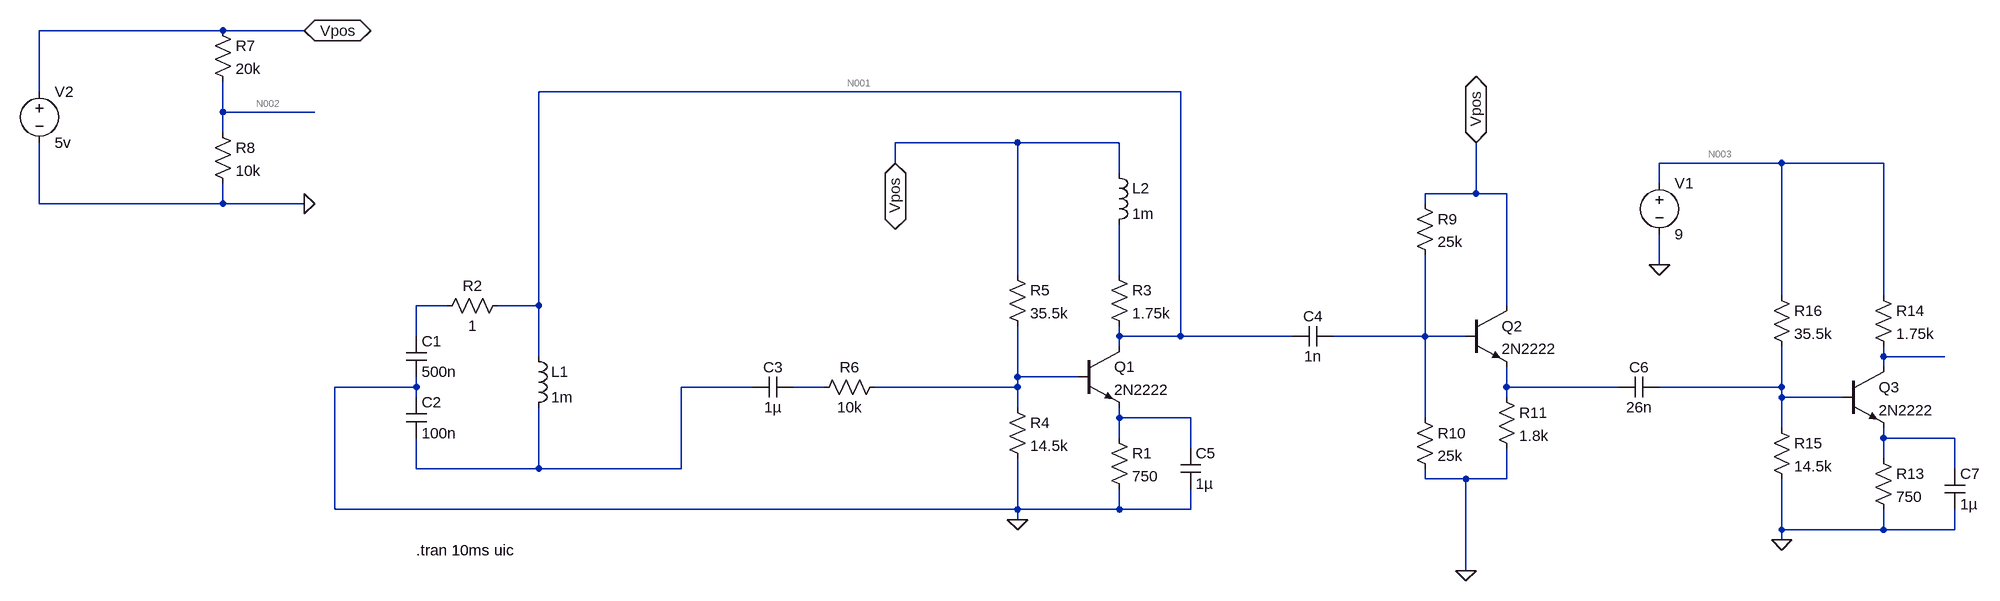
[diagram p0: schematic oscillator.asc]
oscillator.asc, the LTspice schematic file:
Version 4.1
SHEET 1 3016 680
WIRE -192 -432 -480 -432
WIRE -64 -432 -192 -432
WIRE -480 -336 -480 -432
WIRE 1312 -336 304 -336
WIRE -192 -304 -192 -352
WIRE -48 -304 -192 -304
WIRE -192 -272 -192 -304
WIRE 1056 -256 864 -256
WIRE 1216 -256 1056 -256
WIRE 864 -224 864 -256
WIRE 2256 -224 2064 -224
WIRE 2416 -224 2256 -224
WIRE 1216 -208 1216 -256
WIRE 2064 -192 2064 -224
WIRE 1776 -176 1776 -256
WIRE 1776 -176 1696 -176
WIRE 1824 -176 1776 -176
WIRE -480 -160 -480 -256
WIRE -192 -160 -192 -192
WIRE -192 -160 -480 -160
WIRE -64 -160 -192 -160
WIRE 1696 -160 1696 -176
WIRE 2064 -64 2064 -112
WIRE 1056 -48 1056 -256
WIRE 1216 -48 1216 -128
WIRE 2256 -16 2256 -224
WIRE 2416 -16 2416 -224
WIRE 160 0 112 0
WIRE 304 0 304 -336
WIRE 304 0 240 0
WIRE 1824 0 1824 -176
WIRE 112 48 112 0
WIRE 1216 48 1216 32
WIRE 1312 48 1312 -336
WIRE 1312 48 1216 48
WIRE 1488 48 1312 48
WIRE 1696 48 1696 -80
WIRE 1696 48 1552 48
WIRE 1760 48 1696 48
WIRE 1216 64 1216 48
WIRE 304 80 304 0
WIRE 2416 80 2416 64
WIRE 2512 80 2416 80
WIRE 2416 96 2416 80
WIRE 1056 112 1056 32
WIRE 1152 112 1056 112
WIRE 112 128 112 112
WIRE 112 128 -16 128
WIRE 640 128 528 128
WIRE 752 128 704 128
WIRE 1056 128 1056 112
WIRE 1056 128 832 128
WIRE 1824 128 1824 96
WIRE 2000 128 1824 128
WIRE 2256 128 2256 64
WIRE 2256 128 2064 128
WIRE 112 144 112 128
WIRE 1824 144 1824 128
WIRE 2256 144 2256 128
WIRE 2352 144 2256 144
WIRE 1056 160 1056 128
WIRE 1216 176 1216 160
WIRE 1328 176 1216 176
WIRE 1696 176 1696 48
WIRE 2256 192 2256 144
WIRE 1216 208 1216 176
WIRE 2416 208 2416 192
WIRE 2528 208 2416 208
WIRE 1328 224 1328 176
WIRE 2416 240 2416 208
WIRE 112 256 112 208
WIRE 304 256 304 160
WIRE 304 256 112 256
WIRE 528 256 528 128
WIRE 528 256 304 256
WIRE 2528 256 2528 208
WIRE 1696 272 1696 256
WIRE 1760 272 1696 272
WIRE 1824 272 1824 224
WIRE 1824 272 1760 272
WIRE -16 320 -16 128
WIRE 1056 320 1056 240
WIRE 1056 320 -16 320
WIRE 1216 320 1216 288
WIRE 1216 320 1056 320
WIRE 1328 320 1328 288
WIRE 1328 320 1216 320
WIRE 1056 336 1056 320
WIRE 2256 352 2256 272
WIRE 2416 352 2416 320
WIRE 2416 352 2256 352
WIRE 2528 352 2528 320
WIRE 2528 352 2416 352
WIRE 2256 368 2256 352
WIRE 1760 416 1760 272
FLAG -64 -160 0
FLAG -64 -432 Vpos
IOPIN -64 -432 BiDir
FLAG 864 -224 Vpos
IOPIN 864 -224 BiDir
FLAG 1776 -256 Vpos
IOPIN 1776 -256 BiDir
FLAG 1056 336 0
FLAG 1760 416 0
FLAG 2256 368 0
FLAG 2064 -64 0
SYMBOL ind 288 64 R0
SYMATTR InstName L1
SYMATTR Value 1m
SYMBOL cap 96 48 R0
SYMATTR InstName C1
SYMATTR Value 500n
SYMBOL cap 96 144 R0
SYMATTR InstName C2
SYMATTR Value 100n
SYMBOL npn 1152 64 R0
SYMATTR InstName Q1
SYMATTR Value 2N2222
SYMBOL res 1200 192 R0
SYMATTR InstName R1
SYMATTR Value 750
SYMBOL res 256 -16 R90
WINDOW 0 0 56 VBottom 2
WINDOW 3 32 56 VTop 2
SYMATTR InstName R2
SYMATTR Value 1
SYMBOL res 1200 -64 R0
SYMATTR InstName R3
SYMATTR Value 1.75k
SYMBOL res 1040 144 R0
SYMATTR InstName R4
SYMATTR Value 14.5k
SYMBOL res 1040 -64 R0
SYMATTR InstName R5
SYMATTR Value 35.5k
SYMBOL cap 704 112 R90
WINDOW 0 0 32 VBottom 2
WINDOW 3 32 32 VTop 2
SYMATTR InstName C3
SYMATTR Value 1µ
SYMBOL ind 1200 -224 R0
SYMATTR InstName L2
SYMATTR Value 1m
SYMBOL cap 1552 32 R90
WINDOW 0 0 32 VBottom 2
WINDOW 3 32 32 VTop 2
SYMATTR InstName C4
SYMATTR Value 1n
SYMBOL cap 1312 224 R0
SYMATTR InstName C5
SYMATTR Value 1µ
SYMBOL res 848 112 R90
WINDOW 0 0 56 VBottom 2
WINDOW 3 32 56 VTop 2
SYMATTR InstName R6
SYMATTR Value 10k
SYMBOL voltage -480 -352 R0
WINDOW 123 0 0 Left 0
WINDOW 39 0 0 Left 0
SYMATTR InstName V2
SYMATTR Value 5v
SYMBOL res -208 -448 R0
SYMATTR InstName R7
SYMATTR Value 20k
SYMBOL res -208 -288 R0
SYMATTR InstName R8
SYMATTR Value 10k
SYMBOL npn 2352 96 R0
SYMATTR InstName Q3
SYMATTR Value 2N2222
SYMBOL res 2400 224 R0
SYMATTR InstName R13
SYMATTR Value 750
SYMBOL res 2400 -32 R0
SYMATTR InstName R14
SYMATTR Value 1.75k
SYMBOL res 2240 176 R0
SYMATTR InstName R15
SYMATTR Value 14.5k
SYMBOL res 2240 -32 R0
SYMATTR InstName R16
SYMATTR Value 35.5k
SYMBOL cap 2512 256 R0
SYMATTR InstName C7
SYMATTR Value 1µ
SYMBOL npn 1760 0 R0
SYMATTR InstName Q2
SYMATTR Value 2N2222
SYMBOL res 1680 -176 R0
SYMATTR InstName R9
SYMATTR Value 25k
SYMBOL res 1680 160 R0
SYMATTR InstName R10
SYMATTR Value 25k
SYMBOL res 1808 128 R0
SYMATTR InstName R11
SYMATTR Value 1.8k
SYMBOL cap 2064 112 R90
WINDOW 0 0 32 VBottom 2
WINDOW 3 32 32 VTop 2
SYMATTR InstName C6
SYMATTR Value 26n
SYMBOL voltage 2064 -208 R0
WINDOW 123 0 0 Left 0
WINDOW 39 0 0 Left 0
SYMATTR InstName V1
SYMATTR Value 9
TEXT 112 384 Left 2 !.tran 10ms uic

The netlist it stands for:
* oscillator.asc
L1 N001 N009 1m
C1 N005 0 500n
C2 0 N009 100n
Q1 N001 N008 N013 0 2N2222
R1 N013 0 750
R2 N001 N005 1
R3 N004 N001 1.75k
R4 N008 0 14.5k
R5 Vpos N008 35.5k
C3 N010 N009 1µ
L2 Vpos N004 1m
C4 N006 N001 1n
C5 N013 0 1µ
R6 N008 N010 10k
V2 Vpos 0 5v
R7 Vpos N002 20k
R8 N002 0 10k
Q3 N007 N012 N014 0 2N2222
R13 N014 0 750
R14 N003 N007 1.75k
R15 N012 0 14.5k
R16 N003 N012 35.5k
C7 N014 0 1µ
Q2 Vpos N006 N011 0 2N2222
R9 Vpos N006 25k
R10 N006 0 25k
R11 N011 0 1.8k
C6 N012 N011 26n
V1 N003 0 9
.model NPN NPN
.model PNP PNP
.lib standard.bjt
.tran 10ms uic
.backanno
.end

* Results of the author's LTspice run, read from the files saved beside the schematic
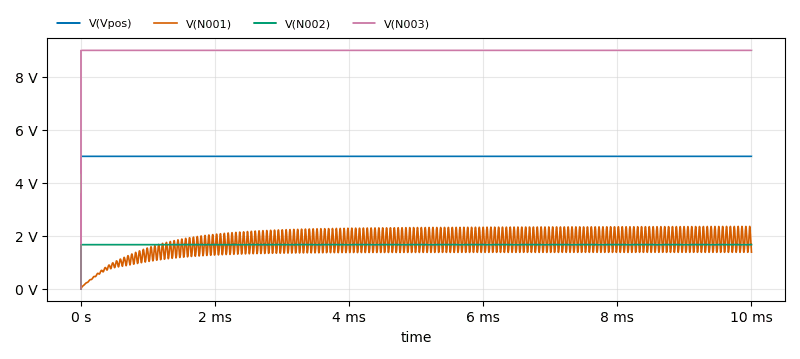
[diagram p1: Transient Analysis of oscillator.asc, plotted from the saved traces]
* Transient Analysis, 1 run:
*   V(Vpos): min 0 V, max 5 V, average 5 V, rms 5 V, last 5 V
*   V(N001): min 0 V, max 2.355 V, average 1.698 V, rms 1.758 V, last 1.384 V
*   V(N002): min 0 V, max 1.667 V, average 1.667 V, rms 1.667 V, last 1.667 V
*   V(N003): min 0 V, max 9 V, average 9 V, rms 9 V, last 9 V